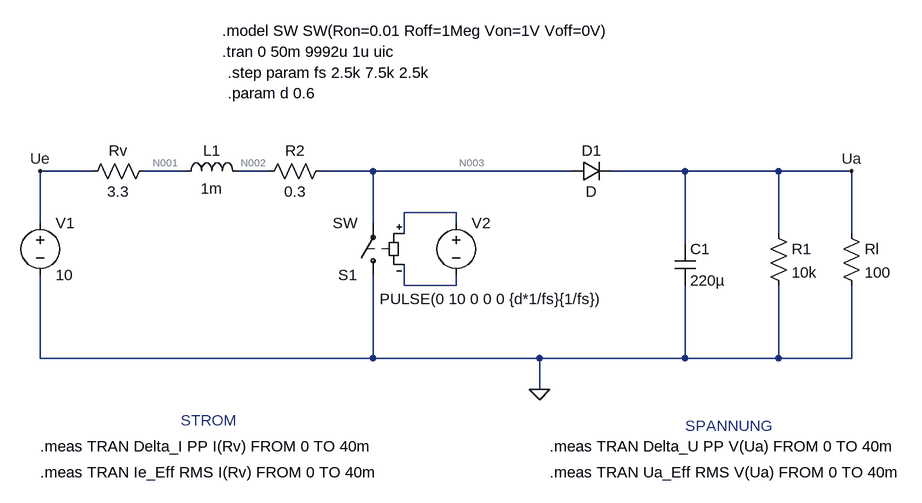
[diagram p0: schematic C4 HSS 2.asc]
C4 HSS 2.asc, the LTspice schematic file:
Version 4.1
SHEET 1 880 680
WIRE -496 112 -576 112
WIRE -352 112 -416 112
WIRE -224 112 -272 112
WIRE -64 112 -144 112
WIRE 240 112 -64 112
WIRE 416 112 304 112
WIRE 560 112 416 112
WIRE 672 112 560 112
WIRE 64 176 -16 176
WIRE -576 192 -576 112
WIRE -64 192 -64 112
WIRE 64 192 64 176
WIRE -16 208 -16 176
WIRE 560 208 560 112
WIRE 672 208 672 112
WIRE 416 224 416 112
WIRE -16 288 -16 256
WIRE 64 288 64 272
WIRE 64 288 -16 288
WIRE -576 400 -576 272
WIRE -64 400 -64 272
WIRE -64 400 -576 400
WIRE 192 400 -64 400
WIRE 416 400 416 288
WIRE 416 400 192 400
WIRE 560 400 560 288
WIRE 560 400 416 400
WIRE 672 400 672 288
WIRE 672 400 560 400
WIRE 192 448 192 400
FLAG -576 112 Ue
FLAG 672 112 Ua
FLAG 192 448 0
SYMBOL voltage -576 176 R0
SYMATTR InstName V1
SYMATTR Value 10
SYMBOL ind -368 128 R270
WINDOW 0 32 56 VTop 2
WINDOW 3 5 56 VBottom 2
SYMATTR InstName L1
SYMATTR Value 1m
SYMBOL diode 240 128 R270
WINDOW 0 32 32 VTop 2
WINDOW 3 0 32 VBottom 2
SYMATTR InstName D1
SYMBOL cap 400 224 R0
SYMATTR InstName C1
SYMATTR Value 220µ
SYMBOL res 656 192 R0
SYMATTR InstName Rl
SYMATTR Value 100
SYMBOL voltage 64 176 R0
WINDOW 3 -118 133 Left 2
SYMATTR Value PULSE(0 10 0 0 0 {d*1/fs}{1/fs})
SYMATTR InstName V2
SYMBOL sw -64 288 R180
SYMATTR InstName S1
SYMBOL res 544 192 R0
SYMATTR InstName R1
SYMATTR Value 10k
SYMBOL res -400 96 R90
WINDOW 0 0 56 VBottom 2
WINDOW 3 32 56 VTop 2
SYMATTR InstName Rv
SYMATTR Value 3.3
SYMBOL res -128 96 R90
WINDOW 0 0 56 VBottom 2
WINDOW 3 32 56 VTop 2
SYMATTR InstName R2
SYMATTR Value 0.3
TEXT -296 -104 Left 2 !.model SW SW(Ron=0.01 Roff=1Meg Von=1V Voff=0V)
TEXT -296 -72 Left 2 !.tran 0 50m 9992u 1u uic
TEXT -576 536 Left 2 !.meas TRAN Delta_I PP I(Rv) FROM 0 TO 40m
TEXT -576 576 Left 2 !.meas TRAN Ie_Eff RMS I(Rv) FROM 0 TO 40m
TEXT 208 536 Left 2 !.meas TRAN Delta_U PP V(Ua) FROM 0 TO 40m
TEXT 208 576 Left 2 !.meas TRAN Ua_Eff RMS V(Ua) FROM 0 TO 40m
TEXT -360 496 Left 2 ;STROM
TEXT 416 504 Left 2 ;SPANNUNG
TEXT -288 -8 Left 2 !.param d 0.6
TEXT -288 -40 Left 2 !.step param fs 2.5k 7.5k 2.5k

The netlist it stands for:
* C4 HSS 2.asc
V1 Ue 0 10
L1 N001 N002 1m
D1 N003 Ua D
C1 Ua 0 220µ
Rl Ua 0 100
V2 N004 N005 PULSE(0 10 0 0 0 {d*1/fs}{1/fs})
S1 0 N003 N004 N005 SW
R1 Ua 0 10k
Rv N001 Ue 3.3
R2 N003 N002 0.3
.model D D
.lib standard.dio
.model SW SW(Ron=0.01 Roff=1Meg Von=1V Voff=0V)
.tran 0 50m 9992u 1u uic
.meas TRAN Delta_I PP I(Rv) FROM 0 TO 40m
.meas TRAN Ie_Eff RMS I(Rv) FROM 0 TO 40m
.meas TRAN Delta_U PP V(Ua) FROM 0 TO 40m
.meas TRAN Ua_Eff RMS V(Ua) FROM 0 TO 40m
* STROM
* SPANNUNG
.param d 0.6
.step param fs 2.5k 7.5k 2.5k
.backanno
.end

* Results of the author's LTspice run, read from the files saved beside the schematic
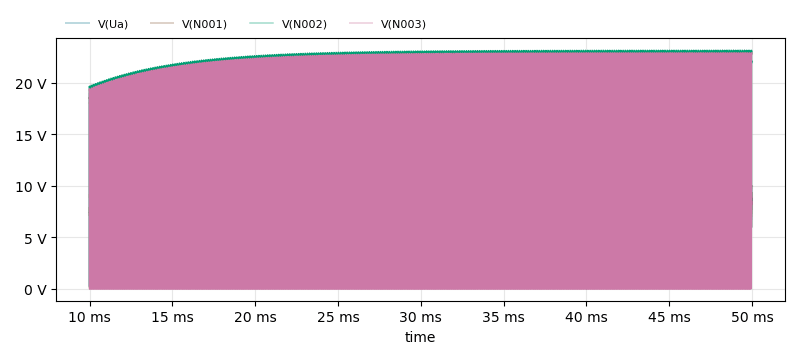
[diagram p1: Transient Analysis of C4 HSS 2.asc, plotted from the saved traces]
* Transient Analysis, 3 runs:
*   V(Ua) [fs=2500]: min 17.82 V, max 22.03 V, average 21.12 V, rms 21.14 V, last 22.01 V
*   V(Ua) [fs=5000]: min 18.39 V, max 21.98 V, average 21.46 V, rms 21.47 V, last 21.98 V
*   V(Ua) [fs=7500]: min 18.5 V, max 22.1 V, average 21.59 V, rms 21.61 V, last 22.1 V
*   V(N001) [fs=2500]: min 4 V, max 10 V, average 6.974 V, rms 7.189 V, last 10 V
*   V(N001) [fs=5000]: min 5.223 V, max 9.304 V, average 7.475 V, rms 7.539 V, last 9.297 V
*   V(N001) [fs=7500]: min 5.683 V, max 8.804 V, average 7.539 V, rms 7.572 V, last 8.794 V
*   V(N002) [fs=2500]: min 2.712 mV, max 23.1 V, average 6.979 V, rms 12.1 V, last 10 V
*   V(N002) [fs=5000]: min 65.37 mV, max 23.04 V, average 7.485 V, rms 12.85 V, last 22.84 V
*   V(N002) [fs=7500]: min 112.4 mV, max 23.16 V, average 7.548 V, rms 12.95 V, last 23.02 V
*   V(N003) [fs=2500]: min 105.6 µV, max 22.84 V, average 6.704 V, rms 11.96 V, last 10 V
*   V(N003) [fs=5000]: min 2.109 mV, max 22.79 V, average 7.255 V, rms 12.72 V, last 22.77 V
*   V(N003) [fs=7500]: min 3.626 mV, max 22.91 V, average 7.325 V, rms 12.82 V, last 22.91 V
* From the log:
*   Measurement: delta_i
*     step  PP(I(Rv))  FROM  TO
*        1  1.81803558941  0  0.04
*        2  1.23685863614  0  0.04
*        3  0.945555746555  0  0.04
*   Measurement: ie_eff
*     step  RMS(I(Rv))  FROM  TO
*        1  1.05572159868  0  0.04
*        2  0.81831667697  0  0.04
*        3  0.773118734883  0  0.04
*   Measurement: delta_u
*     step  PP(V(Ua))  FROM  TO
*        1  4.21078491211  0  0.04
*        2  3.59169578552  0  0.04
*        3  3.60050392151  0  0.04
*   Measurement: ua_eff
*     step  RMS(V(Ua))  FROM  TO
*        1  21.1384357791  0  0.04
*        2  21.4692794744  0  0.04
*        3  21.6060982647  0  0.04